# Altium schematic sheet Memory_Unit.SchDoc
size C
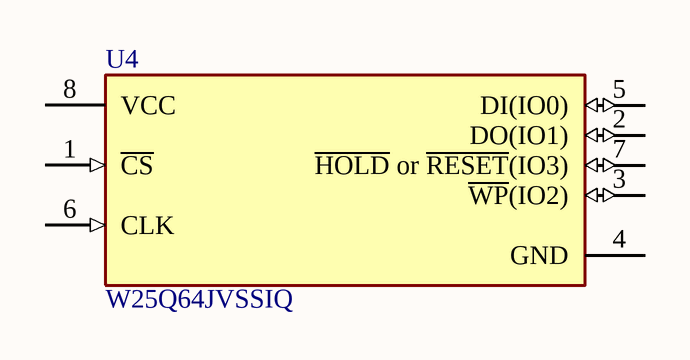
[diagram p0: Memory_Unit.SchDoc]

## Parts
U4  W25Q64JVSSIQ

## Nets

Not connected (* = marked no-connect by the designer): U4 1(~{CS}) 2(DO(IO1)) 3(~{WP}(IO2)) 4(GND) 5(DI(IO0)) 6(CLK) 7(~{HOLD}_or_~{RESET}(IO3)) 8(VCC)

## Notes on the sheet
- CONFIDENTAL. Do not distribute.
- Page Contents:
- Title:
- Company
- Logo
- Date:
- SIZE:
- C
- DWG Num:
- Time:
- Variant:
- Sheet
- Revision:
- of
- Drawn by:
- Checked by:

## Library data of the parts
U4 = W25Q64JVSSIQ: IC FLASH 64MBIT 104MHZ 8SOIC; Manufacturer: Winbond; Memory Type: FLASH,NOR; Interface: SPI,Serial; Max Supply Voltage: 3.6V; Min Supply Voltage: 2.7V; Page Size: 256B; Density: 64MB; Operating Supply Voltage: 3V; Address Bus Width: 24b; Access Time: 6ns; Supplier 1: Arrow Electronics; Manufacturer Part Number: W25Q64JVSSIQ; RoHS: Yes; Category: Flash; Stock 1: 24923; Pricing 1: 1=1.14900, 10=1.03090, 25=1.01110, 50=1.00110, 100=0.92440, 250=0.91670, 500=0.90340, 1000=0.87160, 5000=0.77800 (USD); Mount: Surface Mount; Case/Package: SOIC; Number of Pins: 8; Min Operating Temperature: -40°C; Max Operating Temperature: 85°C; Packaging: Tray; Frequency: 104MHz; RoHS Compliant: Yes; ComponentLink1URL: http://www.winbond.com/resource-files/w25q64jv%20revj%2003272018%20plus.pdf?src-supplier=Digi-Key; ComponentLink1Description: http://www.winbond.com/resource-files/w25q64jv%20revj%2003272018%20plus.pdf?src-supplier=Digi-Key; Supplier Part Number 1: W25Q64JVSSIQ